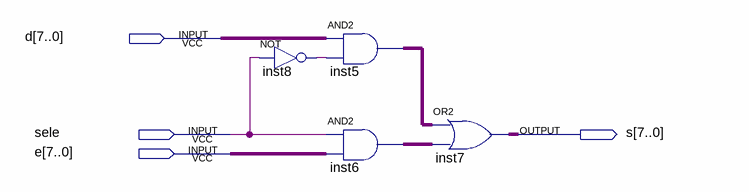
[diagram p0: schematic sheet]
// Quartus schematic sele.bdf as structural Verilog: 4 symbols, 4 pins
module sele (
  input  [7:0] d,
  input  sele,
  input  [7:0] e,
  output [7:0] s
);

  wire inst8_out;
  wire [7:0] inst5_out, inst6_out;

  assign inst5_out = d & {8{inst8_out}};  // AND2 inst5, 8 bits wide
  not inst8 (inst8_out, sele);
  assign inst6_out = {8{sele}} & e;  // AND2 inst6, 8 bits wide
  assign s = inst5_out | inst6_out;  // OR2 inst7, 8 bits wide
endmodule
